# Altium schematic sheet vcp.SchDoc
size A
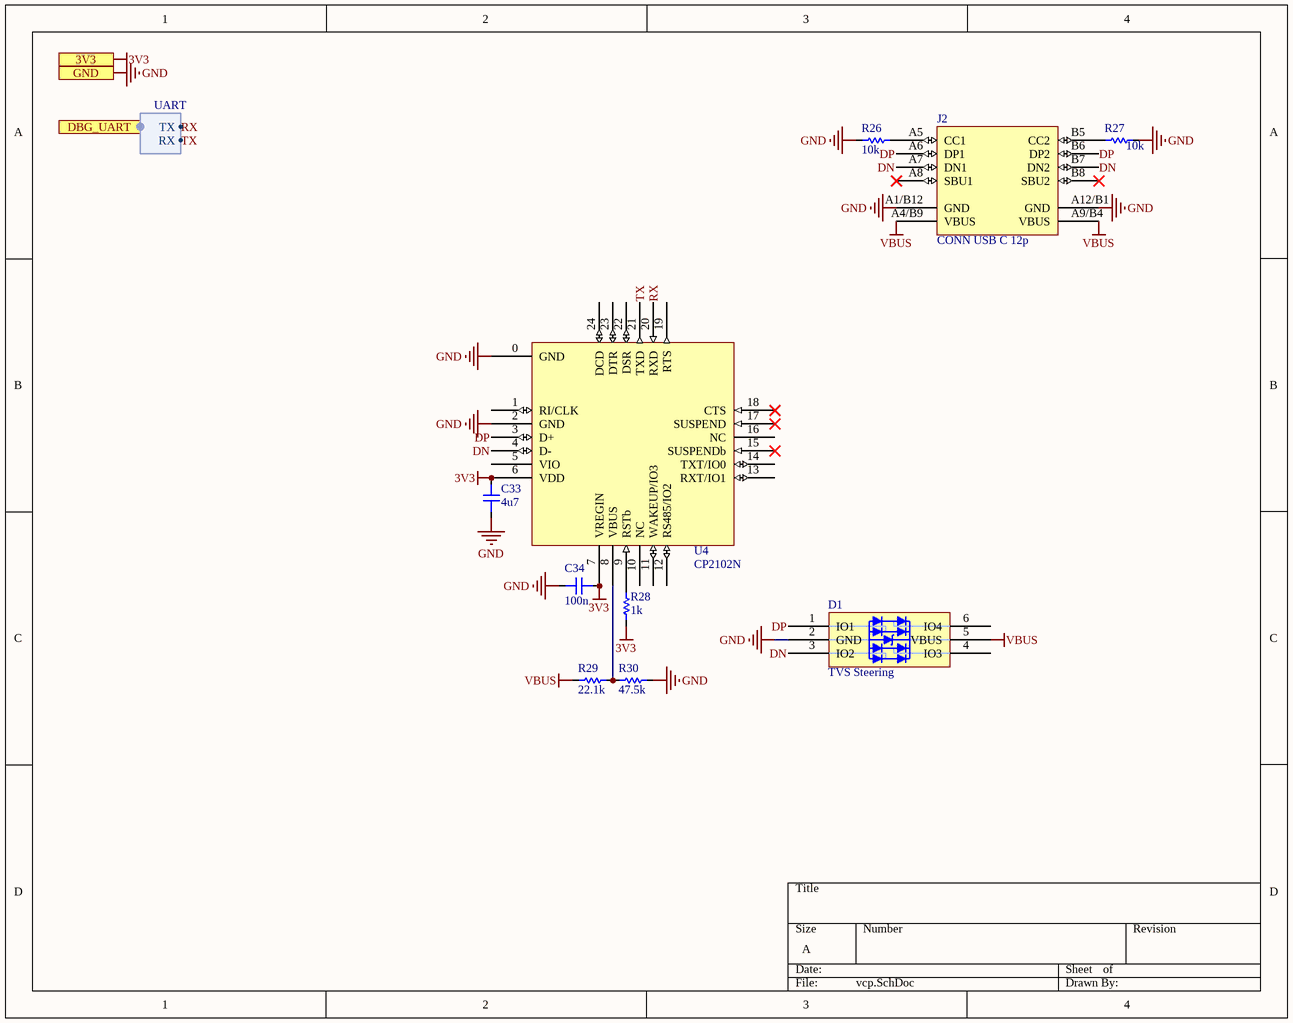
[diagram p0: vcp.SchDoc]

## Parts
C33  4u7  [CAP 0805 L]
C34  100n  [CAP 0805 L]
D1  TVS Steering  [SC-74]
J2  CONN USB C 12p  [CONN USB C 12P]
R26  10k  [RES 0603 L]
R27  10k  [RES 0603 L]
R28  1k  [RES 0603 L]
R29  22.1k  [RES 0603 L]
R30  47.5k  [RES 0603 L]
U4  CP2102N  [VQFN24]

## Ports
3V3, DBG_UART (harness UART), GND

## Harnesses
UART: RX, TX

## Nets
3V3: C33.2 C34.2 R28.1 U4.6(VDD) U4.7(VREGIN) ; port 3V3
GND: C33.1 C34.1 D1.2(GND) J2.A1/B12(GND) J2.A12/B1(GND) R26.2 R27.1 R30.2 U4.0(GND) U4.2(GND) ; port GND
VBUS: D1.5(VBUS) J2.A4/B9(VBUS) J2.A9/B4(VBUS) R29.1
DN: D1.3(IO2) J2.A7(DN1) J2.B7(DN2) U4.4(D-)
DP: D1.1(IO1) J2.A6(DP1) J2.B6(DP2) U4.3(D+)
RX: U4.20(RXD) ; port DBG_UART.TX
TX: U4.21(TXD) ; port DBG_UART.RX
NetJ2_A5: J2.A5(CC1) R26.1
NetJ2_B5: J2.B5(CC2) R27.2
NetR28_2: R28.2 U4.9(RSTb)
NetR29_2: R29.2 R30.1 U4.8(VBUS)

Not connected (* = marked no-connect by the designer): D1 4(IO3) 6(IO4); J2 A8(SBU1)* B8(SBU2)*; U4 1(RI/CLK) 5(VIO) 10(NC) 11(WAKEUP/IO3) 12(RS485/IO2) 13(RXT/IO1) 14(TXT/IO0) 15(SUSPENDb)* 16(NC) 17(SUSPEND)* 18(CTS)* 19(RTS) 22(DSR) 23(DTR) 24(DCD)

## Library data of the parts
C33 C34 = CAP 0805
D1 = DTVS 2Rail 4x: CM1293A-04SO; Supplier 1: Digi-Key; Supplier Part Number 1: CM1293A-04SOOSCT-ND
J2 = CONN USB C 12p: USB - Type C Female 12 SMD USB Connectors RoHS; LCSC Part #: C167321
R26-R30 = RES 0603
U4 = IC USB UART CP2102N: Supplier 1: Digi-Key; Supplier Part Number 1: 336-5888-1-ND